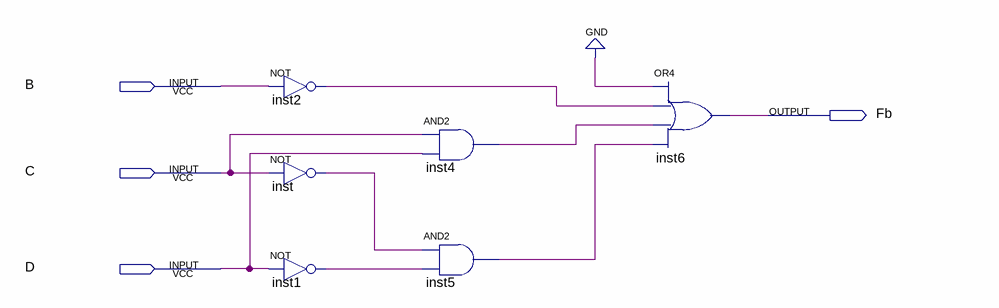
[diagram p0: schematic sheet]
// Quartus schematic Fb.bdf as structural Verilog: 6 symbols, 4 pins
module Fb (
  input  B,
  input  C,
  input  D,
  output Fb
);

  wire inst1_out, inst2_out, inst4_out, inst5_out, inst_out;

  not inst2 (inst2_out, B);
  not inst (inst_out, C);
  not inst1 (inst1_out, D);
  and inst4 (inst4_out, C, D);
  and inst5 (inst5_out, inst_out, inst1_out);
  or inst6 (Fb, 1'b0, inst2_out, inst4_out, inst5_out);
endmodule
